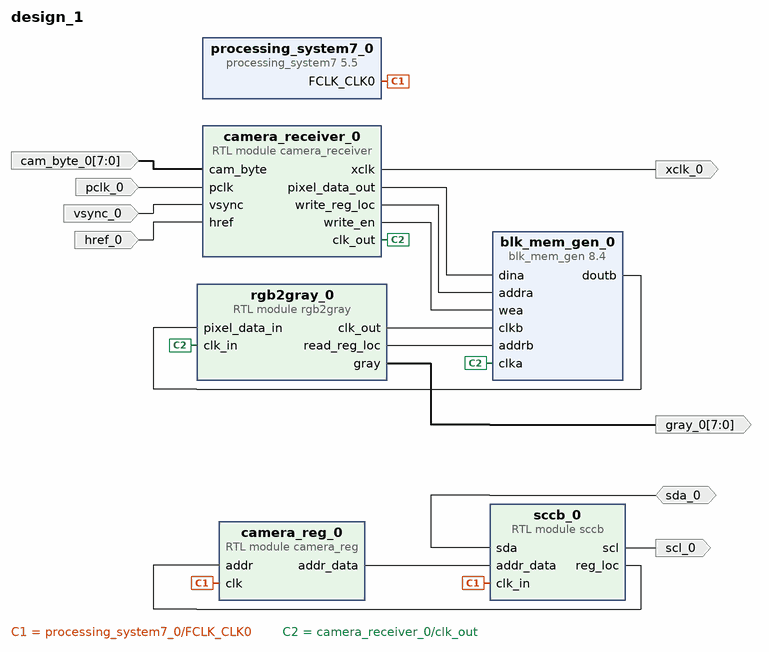
[diagram p0: block diagram of the top level]
# Vivado block design design_1, xc7z020clg400-1, Vivado 2017.4
create_bd_design design_1

create_bd_port -dir O scl_0
create_bd_port -dir IO sda_0
create_bd_port -dir I -from 7 -to 0 cam_byte_0
create_bd_port -dir I pclk_0
create_bd_port -dir I vsync_0
create_bd_port -dir I href_0
create_bd_port -dir O xclk_0
create_bd_port -dir O -from 7 -to 0 gray_0

create_bd_cell -type module -reference camera_reg camera_reg_0
create_bd_cell -type ip -vlnv xilinx.com:ip:processing_system7:5.5 processing_system7_0
set_property -dict [list \
  CONFIG.PCW_FPGA0_PERIPHERAL_FREQMHZ 24 \
  CONFIG.PCW_USE_M_AXI_GP0 0 \
  CONFIG.PCW_GPIO_MIO_GPIO_ENABLE 0 \
] [get_bd_cells processing_system7_0]
# 37 more settings of processing_system7_0 are not shown: defaults, MIO pin electricals, DDR timing, and values the tool derives
create_bd_cell -type ip -vlnv xilinx.com:ip:blk_mem_gen:8.4 blk_mem_gen_0
set_property -dict [list \
  CONFIG.Memory_Type Simple_Dual_Port_RAM \
  CONFIG.Enable_32bit_Address false \
  CONFIG.Use_Byte_Write_Enable false \
  CONFIG.Assume_Synchronous_Clk true \
  CONFIG.Write_Width_A 16 \
  CONFIG.Write_Depth_A 2000 \
  CONFIG.Operating_Mode_A NO_CHANGE \
  CONFIG.Enable_A Always_Enabled \
  CONFIG.Write_Width_B 16 \
  CONFIG.Read_Width_B 16 \
  CONFIG.Enable_B Use_ENB_Pin \
  CONFIG.Register_PortB_Output_of_Memory_Primitives true \
  CONFIG.Use_RSTB_Pin false \
  CONFIG.Port_A_Write_Rate 50 \
  CONFIG.Port_B_Clock 100 \
  CONFIG.Port_B_Enable_Rate 100 \
  CONFIG.use_bram_block Stand_Alone \
] [get_bd_cells blk_mem_gen_0]
create_bd_cell -type module -reference rgb2gray rgb2gray_0
create_bd_cell -type module -reference camera_receiver camera_receiver_0
create_bd_cell -type module -reference sccb sccb_0

# ---- connections ----

connect_bd_net [get_bd_pins camera_reg_0/addr_data] [get_bd_pins sccb_0/addr_data]
connect_bd_net [get_bd_pins sccb_0/reg_loc] [get_bd_pins camera_reg_0/addr]
connect_bd_net [get_bd_pins sccb_0/scl] [get_bd_ports scl_0]
connect_bd_net [get_bd_ports sda_0] [get_bd_pins sccb_0/sda]
connect_bd_net -net cam_byte_0_1 [get_bd_ports cam_byte_0] [get_bd_pins camera_receiver_0/cam_byte]
connect_bd_net -net pclk_0_1 [get_bd_ports pclk_0] [get_bd_pins camera_receiver_0/pclk]
connect_bd_net -net vsync_0_1 [get_bd_ports vsync_0] [get_bd_pins camera_receiver_0/vsync]
connect_bd_net -net href_0_1 [get_bd_ports href_0] [get_bd_pins camera_receiver_0/href]
connect_bd_net [get_bd_pins camera_receiver_0/xclk] [get_bd_ports xclk_0]
# net camera_receiver_0_pixel_data has one end: 
connect_bd_net [get_bd_pins rgb2gray_0/gray] [get_bd_ports gray_0]
connect_bd_net [get_bd_pins processing_system7_0/FCLK_CLK0] [get_bd_pins camera_reg_0/clk] [get_bd_pins sccb_0/clk_in]
connect_bd_net [get_bd_pins camera_receiver_0/clk_out] [get_bd_pins blk_mem_gen_0/clka] [get_bd_pins rgb2gray_0/clk_in]
connect_bd_net [get_bd_pins camera_receiver_0/pixel_data_out] [get_bd_pins blk_mem_gen_0/dina]
connect_bd_net [get_bd_pins rgb2gray_0/clk_out] [get_bd_pins blk_mem_gen_0/clkb]
connect_bd_net -net rgb2gray_0_reg_loc [get_bd_pins rgb2gray_0/read_reg_loc] [get_bd_pins blk_mem_gen_0/addrb]
connect_bd_net [get_bd_pins blk_mem_gen_0/doutb] [get_bd_pins rgb2gray_0/pixel_data_in]
connect_bd_net [get_bd_pins camera_receiver_0/write_reg_loc] [get_bd_pins blk_mem_gen_0/addra]
connect_bd_net [get_bd_pins camera_receiver_0/write_en] [get_bd_pins blk_mem_gen_0/wea]

validate_bd_design
save_bd_design
